# Altium schematic sheet Loads.SchDoc
size A; SheetNumber: 3; SheetTotal: 3
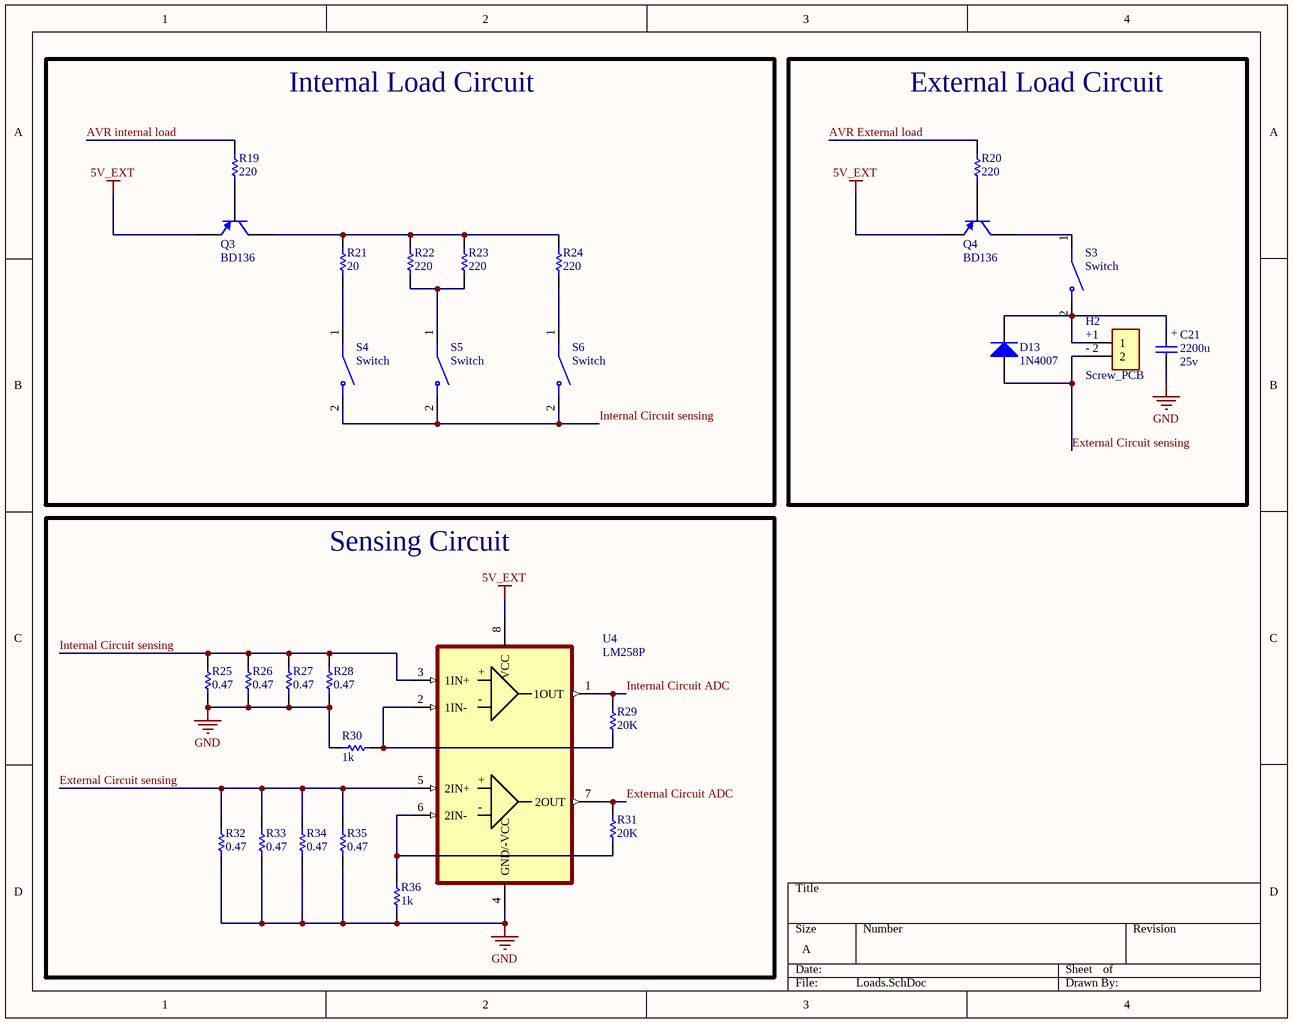
[diagram p0: Loads.SchDoc]

## Parts
C21  Volte: 25v  [MY_E5-13mm]  (hidden comment: 2200u)
D13  1N4007  [My_DO41]
H2  Screw_PCB  [Screw_PCB]
Q3  BD136  [My_TO126]
Q4  BD136  [My_TO126]
R19  220  [MY_(0.25w)_0207_10]
R20  220  [MY_(0.25w)_0207_10]
R21  20  [MY_(2w)_0617_22]
R22  220  [MY_(0.25w)_0207_10]
R23  220  [MY_(0.25w)_0207_10]
R24  220  [MY_(0.25w)_0207_10]
R25  0.47  [R0603]
R26  0.47  [R0603]
R27  0.47  [R0603]
R28  0.47  [R0603]
R29  20K  [R0603]
R30  1k  [R0603]
R31  20K  [R0603]
R32  0.47  [R0603]
R33  0.47  [R0603]
R34  0.47  [R0603]
R35  0.47  [R0603]
R36  1k  [R0603]
S3  Switch  [ON/OFF Switch]
S4  Switch  [ON/OFF Switch]
S5  Switch  [ON/OFF Switch]
S6  Switch  [ON/OFF Switch]
U4  LM258P  [DIP 8 LM258]

## Blocks framed on the sheet
Internal Load Circuit: Q3 R19 R21-R24 S4-S6
External Load Circuit: C21 D13 H2 Q4 R20 S3
Sensing Circuit: R25-R36 U4

## Nets
5V_EXT: Q3.E Q4.E U4.8(VCC)
GND: C21.- R25.2 R26.2 R27.2 R28.2 R30.1 R32.2 R33.2 R34.2 R35.2 R36.2 U4.4(GND/-VCC)
AVR External load: R20.1
AVR internal load: R19.1
External Circuit ADC: R31.1 U4.7(2OUT)
External Circuit sensing: D13.A H2.2 R32.1 R33.1 R34.1 R35.1 U4.5(2IN+)
Internal Circuit ADC: R29.1 U4.1(1OUT)
Internal Circuit sensing: R25.1 R26.1 R27.1 R28.1 S4.2(COM) S5.2(COM) S6.2(COM) U4.3(1IN+)
NetC21_+: C21.+ D13.K H2.1 S3.2(COM)
NetQ3_B: Q3.B R19.2
NetQ3_C: Q3.C R21.1 R22.1 R23.1 R24.1
NetQ4_B: Q4.B R20.2
NetQ4_C: Q4.C S3.1(NO)
NetR21_2: R21.2 S4.1(NO)
NetR22_2: R22.2 R23.2 S5.1(NO)
NetR24_2: R24.2 S6.1(NO)
NetR29_2: R29.2 R30.2 U4.2(1IN-)
NetR31_2: R31.2 R36.1 U4.6(2IN-)

## Notes on the sheet
- (in symbol LM258P) +; -
- (in symbol Screw_PCB) +; -

## Library data of the parts
C21 = Cap Pol: Polar capacitor; ASiD Part Number: C-AS; Value: 2200u
D13 = 1N4007: 1 Amp Diode; ASiD Part Number: 1n4007-AS
H2 = Screw_PCB: PCB to screw header; MF: TE Connectivity; MP: 282837-2; SnapEDA_Link: https://www.snapeda.com/parts/282837-2/TE+Connectivity+AMP+Connectors/view-part/?ref=snap; Price: None; Check_prices: https://www.snapeda.com/parts/282837-2/TE+Connectivity+AMP+Connectors/view-part/?ref=eda; Purchase-URL: https://pricing.snapeda.com/search/part/282837-2/?ref=eda; Value: *; Availability: In Stock; Package: None
Q3 Q4 = BD136: Darlington transistor; ASiD Part Number: BD136-AS
R19-R36 = Res: Standard resistor; ASiD Part Number: Res-AS
  R19 R20 R22-R24: Value: 220
  R21: Value: 20
  R25-R28 R32-R35: Value: 0.47
  R29 R31: Value: 20K
  R30 R36: Value: 1k
S3-S6 = Switch: Rocker Switch, RR5 Series, SPST,OFF-ON,Blk Rocker,I/O Legend, 20A, 125VAC, QC; MP: RR511D1121; MF: E-Switch; Check_prices: https://www.snapeda.com/parts/RR511D1121/E-Switch/view-part/?ref=eda; Value: *; Availability: In Stock; Price: None; Package: None; SnapEDA_Link: https://www.snapeda.com/parts/RR511D1121/E-Switch/view-part/?ref=snap; Purchase-URL: https://pricing.snapeda.com/search/part/RR511D1121/?ref=eda
U4 = LM258P: Dual standard, industrial-grade, operational amplifier 8-PDIP -25 to 85; MF: Texas Instruments; Price: None; Availability: Warning; SnapEDA_Link: https://www.snapeda.com/parts/LM258P/Texas%20Instruments/view-part/386286/?ref=snap; Package: PDIP-8 Texas; MP: LM258P; Value: *; Purchase-URL: https://pricing.snapeda.com/search/part/LM258P/?ref=eda